# Altium schematic sheet MCU.SchDoc
size A4; Revision: C.2
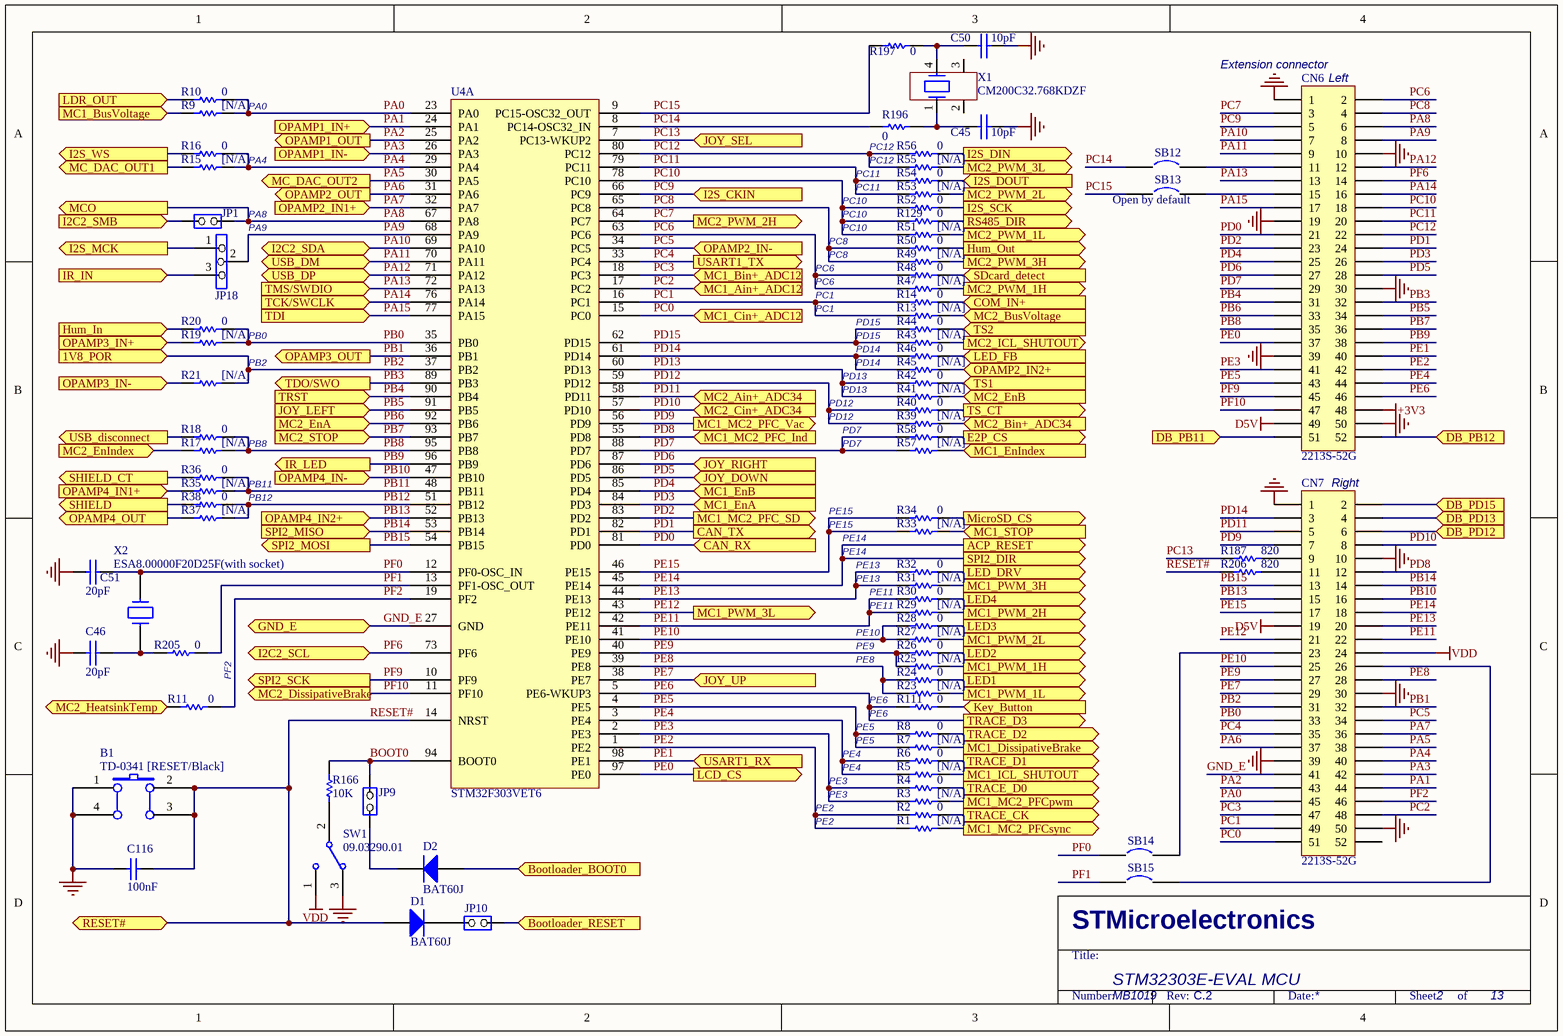
[diagram p0: MCU.SchDoc]

## Parts
B1  TD-0341 [RESET/Black]  [PB10]
C45  10pF  [0603C]
C46  20pF  [0603C]
C50  10pF  [0603C]
C51  20pF  [0603C]
C116  100nF  [0603C]
CN6  2213S-52G  [2*26P]
CN7  2213S-52G  [2*26P]
D1  BAT60J  [SOD-323]
D2  BAT60J  [SOD-323]
JP1  (no value)  [SIP2]
JP9  (no value)  [SIP2]
JP10  (no value)  [SIP2]
JP18  (no value)  [SIP3]
R1  [N/A]  [0603R]
R2  0  [0603R]
R3  [N/A]  [0603R]
R4  0  [0603R]
R5  [N/A]  [0603R]
R6  0  [0603R]
R7  [N/A]  [0603R]
R8  0  [0603R]
R9  [N/A]  [0603R]
R10  0  [0603R]
R11  0  [0603R]
R13  [N/A]  [0603R]
R14  0  [0603R]
R15  [N/A]  [0603R]
R16  0  [0603R]
R17  [N/A]  [0603R]
R18  0  [0603R]
R19  [N/A]  [0603R]
R20  0  [0603R]
R21  [N/A]  [0603R]
R23  [N/A]  [0603R]
R24  0  [0603R]
R25  [N/A]  [0603R]
R26  0  [0603R]
R27  [N/A]  [0603R]
R28  0  [0603R]
R29  [N/A]  [0603R]
R30  0  [0603R]
R31  [N/A]  [0603R]
R32  0  [0603R]
R33  [N/A]  [0603R]
R34  0  [0603R]
R35  [N/A]  [0603R]
R36  0  [0603R]
R37  [N/A]  [0603R]
R38  0  [0603R]
R39  [N/A]  [0603R]
R40  0  [0603R]
R41  [N/A]  [0603R]
R42  0  [0603R]
R43  [N/A]  [0603R]
R44  0  [0603R]
R45  [N/A]  [0603R]
R46  0  [0603R]
R47  [N/A]  [0603R]
R48  0  [0603R]
R49  [N/A]  [0603R]
R50  0  [0603R]
R51  [N/A]  [0603R]
R52  0  [0603R]
R53  [N/A]  [0603R]
R54  0  [0603R]
R55  [N/A]  [0603R]
R56  0  [0603R]
R57  [N/A]  [0603R]
R58  0  [0603R]
R111  0  [0603R]
R129  0  [0603R]
R166  10K  [0603R]
R187  820  [0603R]
R196  0  [0603R]
R197  0  [0603R]
R205  0  [0603R]
R206  820  [0603R]
SB12  (no value)  [JP2_SMD]
SB13  (no value)  [JP2_SMD]
SB14  (no value)  [JP2_SMD]
SB15  (no value)  [JP2_SMD]
SW1  09.03290.01  [SIP3]
U4  STM32F303VET6  [IC149-100-025-B5]  (part A of 2)
X1  CM200C32.768KDZF  [SM8]
X2  ESA8.00000F20D25F(with socket)  [XTAL_socket]

## Ports
1V8_POR (in), ACP_RESET (out), Bootloader_BOOT0 (in), Bootloader_RESET (in), CAN_RX (in), CAN_TX (out), COM_IN+ (in), DB_PB11 (in), DB_PB12 (in), DB_PD12 (in), DB_PD13 (in), DB_PD15 (in), E2P_CS (out), GND_E (bidir), Hum_In (in), Hum_Out (out), I2C2_SCL (bidir), I2C2_SDA (bidir), I2C2_SMB (in), I2S_CKIN (in), I2S_DIN (out), I2S_DOUT (in), I2S_MCK (out), I2S_SCK (out), I2S_WS (out), IR_IN (in), IR_LED (out), JOY_DOWN (in), JOY_LEFT (in), JOY_RIGHT (in), JOY_SEL (in), JOY_UP (in), Key_Button (in), LCD_CS (out), LDR_OUT (in), LED1 (out), LED2 (out), LED3 (out), LED4 (out), LED_DRV (out), LED_FB (in), MC1_Ain+_ADC12 (in), MC1_Bin+_ADC12 (in), MC1_BusVoltage (in), MC1_Cin+_ADC12 (in), MC1_DissipativeBrake (out), MC1_EnA (in), MC1_EnB (in), MC1_EnIndex (in), MC1_ICL_SHUTOUT (out), MC1_MC2_PFC_Ind (in), MC1_MC2_PFC_SD (out), MC1_MC2_PFC_Vac (out), MC1_MC2_PFCpwm (out), MC1_MC2_PFCsync (out), MC1_PWM_1H (out), MC1_PWM_1L (out), MC1_PWM_2H (out), MC1_PWM_2L (out), MC1_PWM_3H (out), MC1_PWM_3L (out), MC1_STOP (in), MC2_Ain+_ADC34 (in), MC2_Bin+_ADC34 (in), MC2_BusVoltage (in), MC2_Cin+_ADC34 (in), MC2_DissipativeBrake (out), MC2_EnA (in), MC2_EnB (in), MC2_EnIndex (in), MC2_HeatsinkTemp (in), MC2_ICL_SHUTOUT (out), MC2_PWM_1H (out), MC2_PWM_1L (out), MC2_PWM_2H (out), MC2_PWM_2L (out), MC2_PWM_3H (out), MC2_PWM_3L (out), MC2_STOP (in), MC_DAC_OUT1 (out), MC_DAC_OUT2 (out), MCO (out), MicroSD_CS (out), OPAMP1_IN+ (in), OPAMP1_IN- (in), OPAMP1_OUT (out), OPAMP2_IN1+ (in), OPAMP2_IN2+ (in), OPAMP2_IN- (in), OPAMP2_OUT (out), OPAMP3_IN+ (in), OPAMP3_IN- (in), OPAMP3_OUT (out), OPAMP4_IN1+ (in), OPAMP4_IN2+ (in), OPAMP4_IN- (in), OPAMP4_OUT (out), RESET# (bidir), RS485_DIR (out), SDcard_detect (in), SHIELD (out), SHIELD_CT (out), SPI2_DIR (out), SPI2_MISO (in), SPI2_MOSI (out), SPI2_SCK (out), TCK/SWCLK (in), TDI (in), TDO/SWO (out), TMS/SWDIO (in), TRACE_CK (out), TRACE_D0 (out), TRACE_D1 (out), TRACE_D2 (out), TRACE_D3 (out), TRST (in), TS1 (in), TS2 (in), TS_CT (out), USART1_RX (in), USART1_TX (out), USB_disconnect (out), USB_DM (bidir), USB_DP (bidir)

## Nets
+3V3: CN6.48
D5V: CN6.49 CN7.19
GND: B1.1(A0) B1.4(A1) C45.2 C46.2 C50.2 C51.2 C116.1 CN6.1 CN6.10 CN6.19 CN6.30 CN6.39 CN6.50 CN7.1 CN7.10 CN7.30 CN7.39 CN7.50 SW1.3
VDD: CN7.24 SW1.1
BOOT0: JP9.2(NO) R166.1 U4.94(BOOT0)
Bootloader_BOOT0: D2.1(A) ; port Bootloader_BOOT0
Bootloader_RESET: JP10.2(NO) ; port Bootloader_RESET
COM_IN+: R14.1 ; port COM_IN+
DB_PB11: CN6.51 ; port DB_PB11
DB_PB12: CN6.52 ; port DB_PB12
DB_PD12: CN7.6 ; port DB_PD12
DB_PD13: CN7.4 ; port DB_PD13
DB_PD15: CN7.2 ; port DB_PD15
E2P_CS: R58.1 ; port E2P_CS
GND_E: CN7.41 U4.27(GND) ; port GND_E
Hum_In: R20.2 ; port Hum_In
Hum_Out: R50.1 ; port Hum_Out
I2C2_SMB: JP1.2(NO) ; port I2C2_SMB
I2S_DIN: R56.1 ; port I2S_DIN
I2S_DOUT: R54.1 ; port I2S_DOUT
I2S_MCK: JP18.1 ; port I2S_MCK
I2S_SCK: R52.1 ; port I2S_SCK
I2S_WS: R16.2 ; port I2S_WS
IR_IN: JP18.3 ; port IR_IN
Key_Button: R111.1 ; port Key_Button
LDR_OUT: R10.2 ; port LDR_OUT
LED1: R24.1 ; port LED1
LED2: R26.1 ; port LED2
LED3: R28.1 ; port LED3
LED4: R30.1 ; port LED4
LED_DRV: R32.1 ; port LED_DRV
LED_FB: R46.1 ; port LED_FB
MC1_BusVoltage: R9.2 ; port MC1_BusVoltage
MC1_DissipativeBrake: R7.1 ; port MC1_DissipativeBrake
MC1_EnIndex: R57.1 ; port MC1_EnIndex
MC1_ICL_SHUTOUT: R5.1 ; port MC1_ICL_SHUTOUT
MC1_MC2_PFCpwm: R3.1 ; port MC1_MC2_PFCpwm
MC1_MC2_PFCsync: R1.1 ; port MC1_MC2_PFCsync
MC1_PWM_1H: R25.1 ; port MC1_PWM_1H
MC1_PWM_1L: R23.1 ; port MC1_PWM_1L
MC1_PWM_2H: R29.1 ; port MC1_PWM_2H
MC1_PWM_2L: R27.1 ; port MC1_PWM_2L
MC1_PWM_3H: R31.1 ; port MC1_PWM_3H
MC1_STOP: R33.1 ; port MC1_STOP
MC2_Bin+_ADC34: R39.1 ; port MC2_Bin+_ADC34
MC2_BusVoltage: R13.1 ; port MC2_BusVoltage
MC2_EnB: R41.1 ; port MC2_EnB
MC2_EnIndex: R17.2 ; port MC2_EnIndex
MC2_HeatsinkTemp: R11.2 ; port MC2_HeatsinkTemp
MC2_ICL_SHUTOUT: R43.1 ; port MC2_ICL_SHUTOUT
MC2_PWM_1H: R47.1 ; port MC2_PWM_1H
MC2_PWM_1L: R51.1 ; port MC2_PWM_1L
MC2_PWM_2L: R53.1 ; port MC2_PWM_2L
MC2_PWM_3H: R49.1 ; port MC2_PWM_3H
MC2_PWM_3L: R55.1 ; port MC2_PWM_3L
MC_DAC_OUT1: R15.2 ; port MC_DAC_OUT1
MicroSD_CS: R34.1 ; port MicroSD_CS
OPAMP2_IN2+: R45.1 ; port OPAMP2_IN2+
OPAMP3_IN+: R19.2 ; port OPAMP3_IN+
OPAMP3_IN-: R21.2 ; port OPAMP3_IN-
OPAMP4_IN1+: R35.2 ; port OPAMP4_IN1+
OPAMP4_OUT: R37.2 ; port OPAMP4_OUT
PA0: CN7.45 R9.1 R10.1 U4.23(PA0)
PA1: CN7.44 U4.24(PA1) ; port OPAMP1_IN+
PA2: CN7.43 U4.25(PA2) ; port OPAMP1_OUT
PA3: CN7.42 U4.26(PA3) ; port OPAMP1_IN-
PA4: CN7.40 R15.1 R16.1 U4.29(PA4)
PA5: CN7.38 U4.30(PA5) ; port MC_DAC_OUT2
PA6: CN7.37 U4.31(PA6) ; port OPAMP2_OUT
PA7: CN7.36 U4.32(PA7) ; port OPAMP2_IN1+
PA8: CN6.6 JP1.1(COMMON) U4.67(PA8) ; port MCO
PA9: CN6.8 JP18.2 U4.68(PA9)
PA10: CN6.7 U4.69(PA10) ; port I2C2_SDA
PA11: CN6.9 U4.70(PA11) ; port USB_DM
PA12: CN6.12 U4.71(PA12) ; port USB_DP
PA13: CN6.13 U4.72(PA13) ; port TMS/SWDIO
PA14: CN6.16 U4.76(PA14) ; port TCK/SWCLK
PA15: CN6.17 U4.77(PA15) ; port TDI
PB0: CN7.33 R19.1 R20.1 U4.35(PB0)
PB1: CN7.32 U4.36(PB1) ; port OPAMP3_OUT
PB2: CN7.31 R21.1 U4.37(PB2) ; port 1V8_POR
PB3: CN6.32 U4.89(PB3) ; port TDO/SWO
PB4: CN6.31 U4.90(PB4) ; port TRST
PB5: CN6.34 U4.91(PB5) ; port JOY_LEFT
PB6: CN6.33 U4.92(PB6) ; port MC2_EnA
PB7: CN6.36 U4.93(PB7) ; port MC2_STOP
PB8: CN6.35 R17.1 R18.1 U4.95(PB8)
PB9: CN6.38 U4.96(PB9) ; port IR_LED
PB10: CN7.16 U4.47(PB10) ; port OPAMP4_IN-
PB11: R35.1 R36.1 U4.48(PB11)
PB12: R37.1 R38.1 U4.51(PB12)
PB13: CN7.15 U4.52(PB13) ; port OPAMP4_IN2+
PB14: CN7.14 U4.53(PB14) ; port SPI2_MISO
PB15: CN7.13 U4.54(PB15) ; port SPI2_MOSI
PC0: CN7.51 U4.15(PC0) ; port MC1_Cin+_ADC12
PC1: CN7.49 R13.2 R14.2 U4.16(PC1)
PC2: CN7.48 U4.17(PC2) ; port MC1_Ain+_ADC12
PC3: CN7.47 U4.18(PC3) ; port MC1_Bin+_ADC12
PC4: CN7.35 U4.33(PC4) ; port USART1_TX
PC5: CN7.34 U4.34(PC5) ; port OPAMP2_IN-
PC6: CN6.2 R47.2 R48.2 U4.63(PC6)
PC7: CN6.3 U4.64(PC7) ; port MC2_PWM_2H
PC8: CN6.4 R49.2 R50.2 U4.65(PC8)
PC9: CN6.5 U4.66(PC9) ; port I2S_CKIN
PC10: CN6.18 R51.2 R52.2 R129.2 U4.78(PC10)
PC11: CN6.20 R53.2 R54.2 U4.79(PC11)
PC12: CN6.22 R55.2 R56.2 U4.80(PC12)
PC13: R187.1 U4.7(PC13-WKUP2) ; port JOY_SEL
PC14: R196.2 SB12.1 U4.8(PC14-OSC32_IN)
PC15: R197.2 SB13.1 U4.9(PC15-OSC32_OUT)
PD0: CN6.21 U4.81(PD0) ; port CAN_RX
PD1: CN6.24 U4.82(PD1) ; port CAN_TX
PD2: CN6.23 U4.83(PD2) ; port MC1_MC2_PFC_SD
PD3: CN6.26 U4.84(PD3) ; port MC1_EnA
PD4: CN6.25 U4.85(PD4) ; port MC1_EnB
PD5: CN6.28 U4.86(PD5) ; port JOY_DOWN
PD6: CN6.27 U4.87(PD6) ; port JOY_RIGHT
PD7: CN6.29 R57.2 R58.2 U4.88(PD7)
PD8: CN7.12 U4.55(PD8) ; port MC1_MC2_PFC_Ind
PD9: CN7.7 U4.56(PD9) ; port MC1_MC2_PFC_Vac
PD10: CN7.8 U4.57(PD10) ; port MC2_Cin+_ADC34
PD11: CN7.5 U4.58(PD11) ; port MC2_Ain+_ADC34
PD12: R39.2 R40.2 U4.59(PD12)
PD13: R41.2 R42.2 U4.60(PD13)
PD14: CN7.3 R45.2 R46.2 U4.61(PD14)
PD15: R43.2 R44.2 U4.62(PD15)
PE0: CN6.37 U4.97(PE0) ; port LCD_CS
PE1: CN6.40 U4.98(PE1) ; port USART1_RX
PE2: CN6.42 R1.2 R2.2 U4.1(PE2)
PE3: CN6.41 R3.2 R4.2 U4.2(PE3)
PE4: CN6.44 R5.2 R6.2 U4.3(PE4)
PE5: CN6.43 R7.2 R8.2 U4.4(PE5)
PE6: CN6.46 R111.2 U4.5(PE6-WKUP3) ; port TRACE_D3
PE7: CN7.29 U4.38(PE7) ; port JOY_UP
PE8: CN7.28 R23.2 R24.2 U4.39(PE8)
PE9: CN7.27 R25.2 R26.2 U4.40(PE9)
PE10: CN7.25 R27.2 R28.2 U4.41(PE10)
PE11: CN7.22 R29.2 R30.2 U4.42(PE11)
PE12: CN7.21 U4.43(PE12) ; port MC1_PWM_3L
PE13: CN7.20 R31.2 R32.2 U4.44(PE13)
PE14: CN7.18 U4.45(PE14) ; port ACP_RESET, port SPI2_DIR
PE15: CN7.17 R33.2 R34.2 U4.46(PE15)
PF0: C51.1 SB14.1 U4.12(PF0-OSC_IN) X2.2
PF1: R205.1 SB15.1 U4.13(PF1-OSC_OUT)
PF2: CN7.46 R11.1 U4.19(PF2)
PF6: CN6.14 U4.73(PF6) ; port I2C2_SCL
PF9: CN6.45 U4.10(PF9) ; port SPI2_SCK
PF10: CN6.47 U4.11(PF10) ; port MC2_DissipativeBrake
RESET#: B1.2(B0) B1.3(B1) C116.2 D1.1(A) R206.2 U4.14(NRST) ; port RESET#
RS485_DIR: R129.1 ; port RS485_DIR
SDcard_detect: R48.1 ; port SDcard_detect
SHIELD: R38.2 ; port SHIELD
SHIELD_CT: R36.2 ; port SHIELD_CT
TRACE_CK: R2.1 ; port TRACE_CK
TRACE_D0: R4.1 ; port TRACE_D0
TRACE_D1: R6.1 ; port TRACE_D1
TRACE_D2: R8.1 ; port TRACE_D2
TS1: R42.1 ; port TS1
TS2: R44.1 ; port TS2
TS_CT: R40.1 ; port TS_CT
USB_disconnect: R18.2 ; port USB_disconnect
NetC45_1: C45.1 R196.1 X1.1
NetC46_1: C46.1 R205.2 X2.1
NetC50_1: C50.1 R197.1 X1.4
NetCN6_11: CN6.11 SB12.2
NetCN6_15: CN6.15 SB13.2
NetCN7_9: CN7.9 R187.2
NetCN7_11: CN7.11 R206.1
NetCN7_23: CN7.23 SB14.2
NetCN7_26: CN7.26 SB15.2
NetD1_2: D1.2(K) JP10.1(COMMON)
NetD2_2: D2.2(K) JP9.1(COMMON)
NetR166_2: R166.2 SW1.2

Not connected (* = marked no-connect by the designer): CN7 52; X1 2 3

## Notes on the sheet
- PA0
- (near CN6) Extension connector
- (near CN6) Left
- PA4
- PC11
- PC12
- PA8
- PA9
- PC8
- PC10
- (near SB13) Open by default
- PC1
- PC6
- PB0
- PB2
- PD13
- PD14
- PD15
- PB8
- PD12
- PD7
- PB11
- PB12
- PE15
- (near CN7) Right
- PE14
- PE13
- PE9
- PE10
- PE11
- PF2
- PE8
- PE6
- PE3
- PE4
- PE5
- PE2
- STM32303E-EVAL MCU
- MB1019
- 2
- 13
- STMicroelectronics
- Title:
- Number:
- Rev:
- Date:
- Sheet       of

## Library data of the parts
B1 = SW PUSHBUTTON: SE PUSHBUTTON
C45 C46 C50 C51 = CAP: Capacitor
C116 = CAP: Capacitor; Value: 100pF; Published: 8-Jun-2000; Revision: July-2002: Re-released for DXP Platform.; Publisher: Altium Limited
CN6 CN7 = Header 26X2_1: Header, 26-Pin, Dual row; Revision: 17-Jul-2002: Re-released for DXP Platform.; Publisher: Altium Limited
D1 D2 = Diode: Default Diode; Code - JEDEC: DO-214-AB; Published: 8-Jun-2000; Revision: July-2002: Re-released for DXP Platform.; Publisher: Altium Limited
JP1 JP9 JP10 = JP2
JP18 = Jumper3
R1-R11 R13-R21 R23-R58 R111 R129 R187 R196 R197 R205 R206 = Res1: Resistor; Value: 1K; Published: 8-Jun-2000; Revision: July-2002: Re-released for DXP Platform.; Publisher: Altium Limited
R166 = res1: Resistor; Value: 1K; Published: 8-Jun-2000; Revision: July-2002: Re-released for DXP Platform.; Publisher: Altium Limited
SB12-SB15 = Circuit Breaker: Published: 24-Mar-1999; Revision: July-2002: Re-released for DXP Platform.; Publisher: Altium Limited
SW1 = SW-SPDT: SPDT Subminiature Toggle Switch, Right Angle Mounting, Vertical Actuation; Revision 1: Jul-2002: Re-released for DXP Platform.; Revision 2: 17-Dec-2003: Schematic revised, PCB Footprint replaced.; Published: 24-Mar-1999; Datasheet: Latest Revision: 05-Dec-2000; Publisher: Altium Limited
U4 = STM32F303VCT6
X1 = MC306
X2 = CRYSTAL